# Altium schematic sheet Protection_Circuit.SchDoc
size A4; SheetNumber: 3; SheetTotal: 7
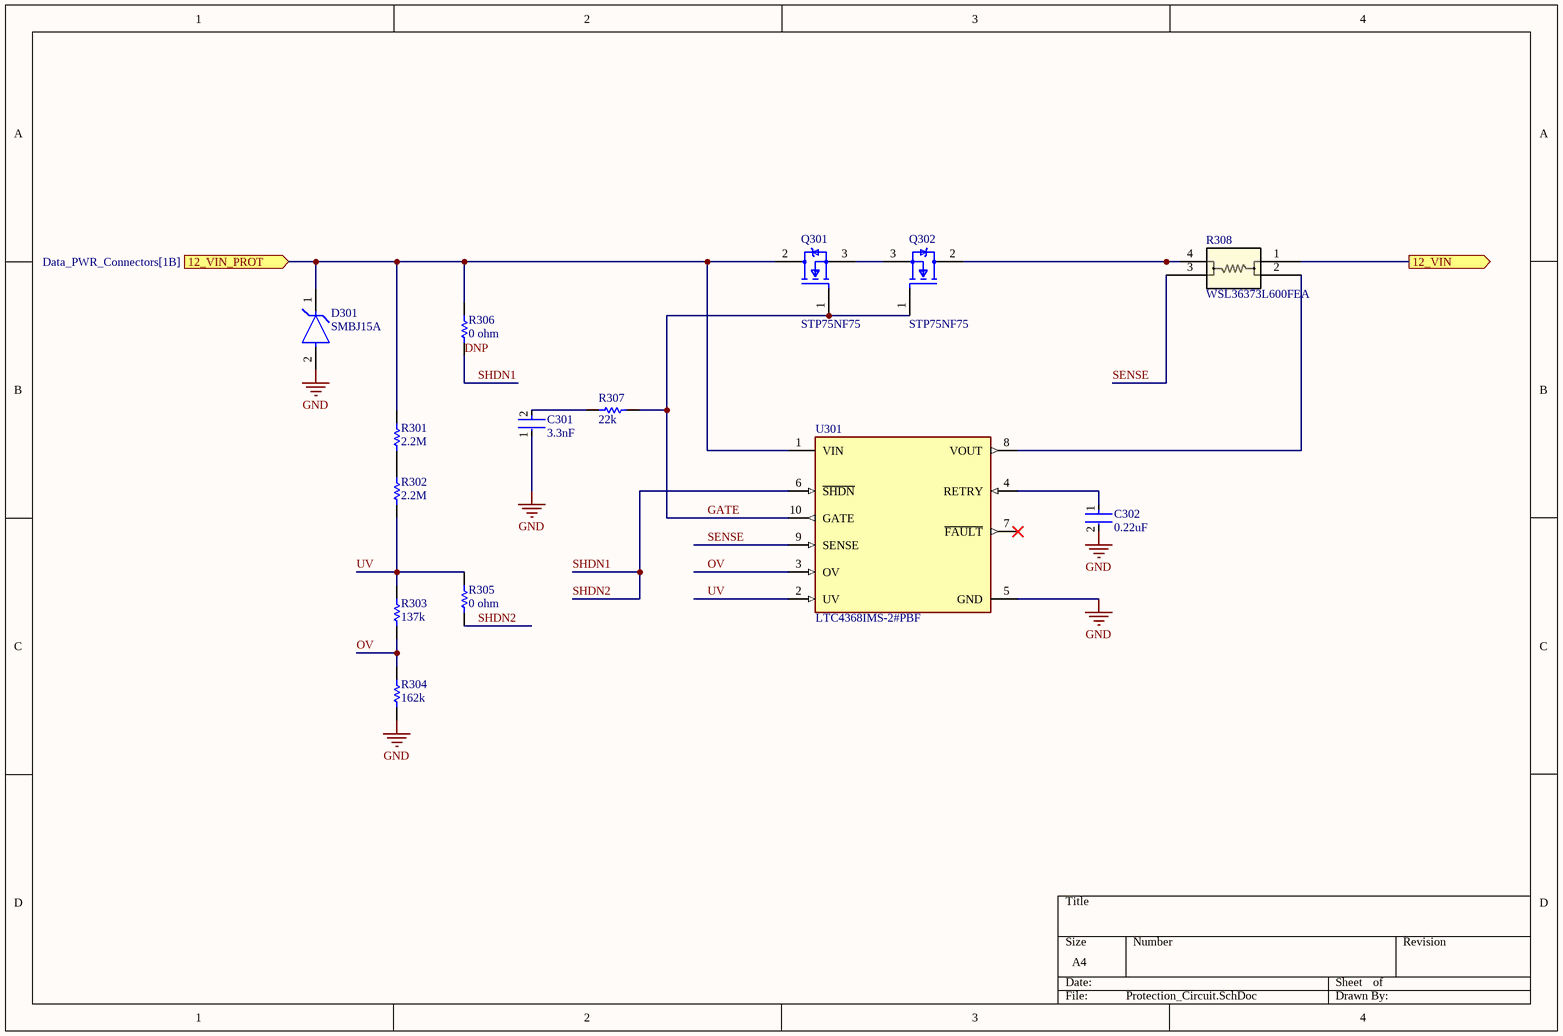
[diagram p0: Protection_Circuit.SchDoc]

## Parts
C301  3.3nF  [FP-GRM216-0_1-IPC_B]
C302  0.22uF  [FP-C0805C-DN-MFG]
D301  SMBJ15A  [FP-SMBJ-MFG]
Q301  STP75NF75  [FP-TO-220-POA0015988-MFG]
Q302  STP75NF75  [FP-TO-220-POA0015988-MFG]
R301  2.2M  [RESC2013X70X40ML20T20]
R302  2.2M  [RESC2013X70X40ML20T20]
R303  137k  [RESC2013X70X40LL20T20]
R304  162k  [RESC2013X70X40NL20T20]
R305  0 ohm  [RESC2013X50X30LL20T20]
R306  0 ohm  [RESC2013X50X30LL20T20]
R307  22k  [RESC2013X60X40ML20T25]
R308  WSL36373L600FEA  [WSL3637_VIS]
U301  LTC4368IMS-2#PBF  [FP-MS-10-05-08-1661-IPC_A]

## Ports
12_VIN (out, see Data_PWR_Connectors[1B], Data_PWR_Connectors[4B], Power_Management[1A], Power_Management[1C], Power_Management[3B], Switching_Circuits[3B], Switching_Circuits[3C], Switching_Circuits[6B], Switching_Circuits[6C]), 12_VIN_PROT (in, see Data_PWR_Connectors[1B])

## Nets
GND: C301.1 C302.2 D301.2(A) R304.1 U301.5(GND)
12_VIN: R308.1 ; port 12_VIN
12_VIN_PROT: D301.1(C) Q301.2(D) R301.2 R306.2 U301.1(VIN) ; port 12_VIN_PROT
GATE: Q301.1(G) Q302.1(G) R307.2 U301.10(GATE)
OV: R303.1 R304.2 U301.3(OV)
SENSE: R308.3 U301.9(SENSE)
SHDN1: R305.1 R306.1 U301.6(~{SHDN})  [also labelled SHDN2]
UV: R302.1 R303.2 R305.2 U301.2(UV)
NetC301_2: C301.2 R307.1
NetC302_1: C302.1 U301.4(RETRY)
NetQ301_3: Q301.3(S) Q302.3(S)
NetQ302_2: Q302.2(D) R308.4
NetR301_1: R301.1 R302.2
NetR308_2: R308.2 U301.8(VOUT)

Not connected (* = marked no-connect by the designer): U301 7(~{FAULT})*

## Notes on the sheet
- (near R306) DNP

## Library data of the parts
C301 = CMP-2007-00889-2: Chip Multilayer Ceramic Capacitors for General Purpose, 0805, 3300pF, C0G, 30ppm/°C, 5%, 50V; Insulation Resistance: 10GR; Mount: Surface Mount; Case/Package: 0805; Case Code (Imperial): 0805; Lead Free: Lead Free; RoHS Compliant: Yes; Dielectric: C0G; Material: Ceramic; Size: 0.6mm; Voltage Rating (DC): 50V; Voltage: 50V; Termination: SMD/SMT; Case Code (Metric): 2012; Construction: Flat; Max Operating Temperature: 125°C; Series: GRM; Min Operating Temperature: -55°C; Temperature Coefficient: 30ppm/°C; Packaging: Tape and Reel; Height: 0.6mm; Capacitance: 3.3nF; REACH SVHC: No SVHC; Width: 0.049inch; Length: 2mm; Thickness: 0.028inch; Voltage Rating: 50V; Tolerance: 5%; Number of Pins: 2; Package Quantity: 1; Dielectric Material: Ceramic; Depth: 1.25mm
C302 = CMP-1036-04552-2: CAP CER 0.22UF 50V X7R 0805; Manufacturer: KEMET; Manufacturer Part Number: C0805C224K5RACTU; Value: 0.22 μF; Temperature Coefficient: 30ppm/°C; Material: Ceramic; Tolerance: 0.1; ComponentLink2URL: https://content.kemet.com/datasheets/KEM_C1003_C0G_SMD.pdf; Temperature Characteristic: X7R; Device Class L3: Ceramic Capacitors; Lead Free: Yes; Temperature: -55°C to +125°C; RoHS: TRUE; Capacitance: 0.22 μF; Automotive: No; Octopart: https://octopart.com/c0805c224k5ractu-kemet-144670; Temperature Range Low: -55°C; Height: 0.88mm; Device Class L1: Passive Components; Digikey Description: CAP CER 0.22UF 50V X7R 0805; ComponentLink2Description: Datasheet; Mouser Description: CAP CER 0.22UF 50V X7R 0805; Category: Cap; Ipc Land Pattern Name: CAPC200125X78; Temperature Range High: +125°C; Package: C0805C-DN; Device Class L2: Capacitors; Voltage Rating: 50 V
D301 = CMP-07401-000033-1: TVS DIODE 15VWM 24.4VC SMB; Max Breakdown Voltage: 19.2V; Reverse Standoff Voltage: 15V; Number of Elements: 1; Diode Type: ZENER; Max Reverse Leakage Current: 5uA; Operating Supply Voltage: 3.5V; Element Configuration: Single; Reverse Breakdown Voltage: 16.7V; Peak Pulse Power: 600W; Peak Pulse Current: 24A; Polarity: Unidirectional; Clamping Voltage: 24.4V; ESD Protection: Yes; Test Current: 1mA; Power Line Protection: No; Max Surge Current: 100A; Min Operating Temperature: -55°C; Number of Pins: 2; Case/Package: DO-214AA; Number of Channels: 1; Series: SMBJ; Height: 2.42mm; Resistor Type: Zener; Max Power Dissipation: 600W; REACH SVHC: No SVHC; Package Quantity: 1; Breakdown Voltage: 19.2V; Radiation Hardening: No; Direction: Unidirectional; Number of Unidirectional Channels: 1; Termination: SMD/SMT; Length: 4.57mm; Width: 3.94mm; Packaging: Tape and Reel; Leakage Current: 5uA; RoHS Compliant: Yes; Mount: Surface Mount; Min Breakdown Voltage: 16.7V; Max Operating Temperature: 150°C
Q301 Q302 = CMP-12198-000040-1: MOSFET N-CH 75V 80A TO220AB; Power Dissipation: 300W; Drain-source On Resistance-Max: 11mR; Turn-On Delay Time: 25ns; Rise Time: 100ns; Threshold Voltage: 3V; Input Capacitance: 3.7nF; Number of Elements: 1; Polarity: N-CHANNEL; Fall Time: 30ns; Drain to Source Resistance: 9.5mR; Element Configuration: Single; Gate to Source Voltage (Vgs): 20V; Turn-Off Delay Time: 66ns; Series: STripFET™; Radiation Hardening: No; Max Operating Temperature: 175°C; Width: 4.6mm; Package Quantity: 50; Drain to Source Breakdown Voltage: 75V; Number of Pins: 3; Height: 9.15mm; Continuous Drain Current (ID): 80A; Max Power Dissipation: 300W; RoHS Compliant: Yes; REACH SVHC: No SVHC; Packaging: Rail/Tube; Drain to Source Voltage (Vdss): 75V; On-State Resistance: 11mR; Length: 10.4mm; Mount: Through Hole; Rds On Max: 11mR; Current Rating: 80A; Lead Free: Lead Free; Weight: 0.02lb; Voltage Rating (DC): 75V; Min Operating Temperature: -55°C; Case/Package: TO-220
R301 R302 = CMP-2001-00379-1: Part Number: ERJ-6GEYJ225V; Manufacturer: Panasonic
R303 = CMP-1013-00750-2: Part Number: ERJ-6ENF1373V; Manufacturer: Panasonic
R304 = CMP-2001-04455-1: Manufacturer: Panasonic; Part Number: ERJ-6ENF1623V
R305 R306 = CMP-2001-04896-1: Manufacturer: Vishay Dale; Part Number: CRCW08050000Z0EA
R307 = CMP-2001-00614-1: Manufacturer: Panasonic; Part Number: ERA6AEB223V
R308 = WSL36373L600FEA: Power Field-Effect Transistor, 80A I(D), 75V, 0.011ohm, 1-Element, N-Channel, Silicon, Metal-oxide Semiconductor FET, TO-220AB; Mfr_Name: Vishay; Manufacturer: STMicroelectronics; Manufacturer Part Number: STP75NF75; Package Body Material: Plastic; Avalanche Energy Rating (Eas): 700mJ; Case Connection: DRAIN; Drain Current-Max (Abs) (ID): 75A; Drain-source On Resistance-Max: 11mR; Number of Elements: 1; Operating Mode: ENHANCEMENT MODE; Power Dissipation-Max (Abs): 300W; Pulsed Drain Current-Max (IDM): 320A; Surface Mount: No; Transistor Application: SWITCHING; Qualification Status: Not Qualified; RefDes: RefDes; Type: Type; Supplier: Arrow Electronics; Supplier Part Number: STP75NF75; RoHS: Yes; Category: MOSFETs; Stock: 52850; Pricing: 1000=0.7152 (USD); Pins: 3; Package Shape: Rectangular; Terminal Finish: Tin; Transistor Element Material: SILICON; Max Operating Temperature: 175°C; JESD-609 Code: e3; Package Style: FLANGE MOUNTMeter; Polarity/Channel Type: N-CHANNEL; Drain Current-Max (ID): 80A; DS Breakdown Voltage-Min: 75V; FET Technology: METAL-OXIDE SEMICONDUCTOR; JESD-30 Code: R-PSFM-T3; Terminal Form: Through Hole; Terminal Position: SINGLE; RoHS Compliant: Yes; Reach SVHC Compliant: No; JEDEC-95 Code: TO-220AB; ComponentLink1URL: https://datasheet.ciiva.com:443/pdfs/VipMasterIC/IC/SGST/SGSTS28063/SGSTS28063-1.pdf?src-supplier=IHS+Markit; ComponentLink1Description: https://datasheet.ciiva.com:443/pdfs/VipMasterIC/IC/SGST/SGSTS28063/SGSTS28063-1.pdf?src-supplier=IHS+Markit; ComponentLink2URL: https://datasheet.ciiva.com/15137/getdatasheetpartid-65453-15137299.pdf?src-supplier=Verical; ComponentLink2Description: https://datasheet.ciiva.com/15137/getdatasheetpartid-65453-15137299.pdf?src-supplier=Verical; ComponentLink3URL: https://datasheet.ciiva.com/14170/qnstm-fet-stp75-en-14170267.pdf?src-supplier=Distrelec; ComponentLink3Description: https://datasheet.ciiva.com/14170/qnstm-fet-stp75-en-14170267.pdf?src-supplier=Distrelec; ComponentLink4URL: https://datasheet.ciiva.com/6380/cd00002771-6380175.pdf?src-supplier=Digikey; ComponentLink4Description: https://datasheet.ciiva.com/6380/cd00002771-6380175.pdf?src-supplier=Digikey; ComponentLink5URL: https://datasheet.ciiva.com/16372/cd00002771-16372746.pdf?src-supplier=Future+Electronics; ComponentLink5Description: https://datasheet.ciiva.com/16372/cd00002771-16372746.pdf?src-supplier=Future+Electronics
U301 = CMP-09131-000012-1: IC SURGE SUPPRESSION ADJ 10MSOP